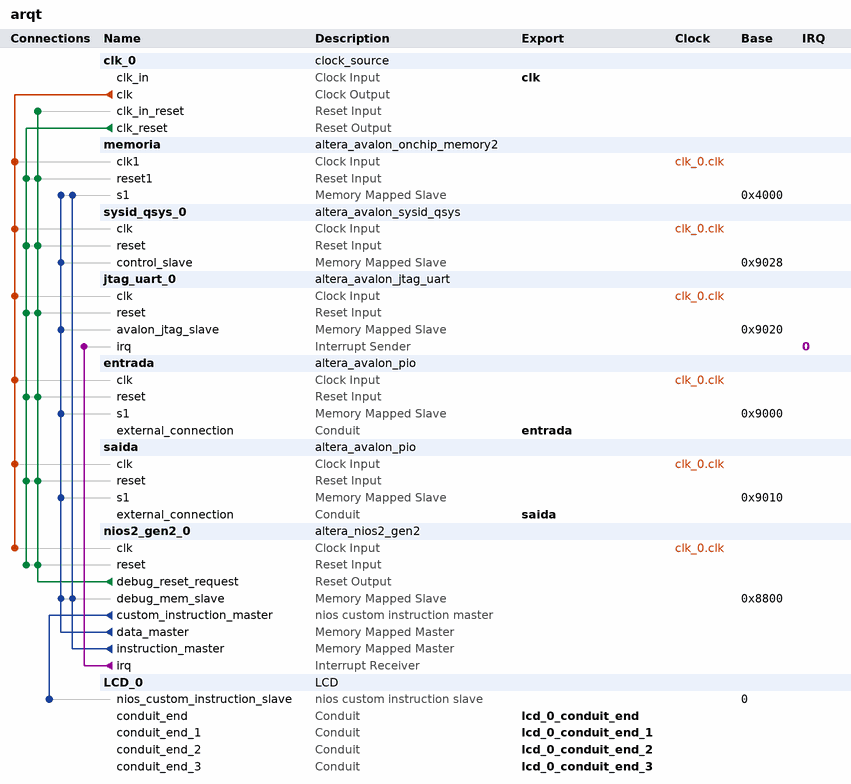
[diagram p0: system contents]
# Platform Designer (Qsys) system arqt, Cyclone IV E EP4CE6E22C8
# Parameters at their usual value, and those the tool derives, are not listed.
package require -exact qsys 15.0
create_system arqt
set_project_property DEVICE_FAMILY {Cyclone IV E}
set_project_property DEVICE EP4CE6E22C8

add_instance clk_0 clock_source 15.0
set_instance_parameter_value clk_0 clockFrequency 50000000

add_instance memoria altera_avalon_onchip_memory2 15.0
set_instance_parameter_value memoria dataWidth 32
set_instance_parameter_value memoria dualPort false
set_instance_parameter_value memoria initMemContent true
set_instance_parameter_value memoria initializationFileName onchip_mem.hex
set_instance_parameter_value memoria memorySize 8196

add_instance sysid_qsys_0 altera_avalon_sysid_qsys 15.0
set_instance_parameter_value sysid_qsys_0 id 0

add_instance jtag_uart_0 altera_avalon_jtag_uart 15.0
set_instance_parameter_value jtag_uart_0 simInteractiveOptions NO_INTERACTIVE_WINDOWS

add_instance entrada altera_avalon_pio 15.0
set_instance_parameter_value entrada direction Input
set_instance_parameter_value entrada width 4

add_instance saida altera_avalon_pio 15.0
set_instance_parameter_value saida direction Output
set_instance_parameter_value saida width 4

add_instance nios2_gen2_0 altera_nios2_gen2 15.0
set_instance_parameter_value nios2_gen2_0 dcache_size 2048
set_instance_parameter_value nios2_gen2_0 exceptionSlave memoria.s1
set_instance_parameter_value nios2_gen2_0 icache_size 4096
set_instance_parameter_value nios2_gen2_0 impl Tiny
set_instance_parameter_value nios2_gen2_0 resetSlave memoria.s1

add_instance LCD_0 LCD 1.0

# connections
add_connection clk_0.clk entrada.clk clock
add_connection clk_0.clk jtag_uart_0.clk clock
add_connection clk_0.clk memoria.clk1 clock
add_connection clk_0.clk nios2_gen2_0.clk clock
add_connection clk_0.clk saida.clk clock
add_connection clk_0.clk sysid_qsys_0.clk clock
add_connection clk_0.clk_reset entrada.reset reset
add_connection clk_0.clk_reset jtag_uart_0.reset reset
add_connection clk_0.clk_reset memoria.reset1 reset
add_connection clk_0.clk_reset nios2_gen2_0.reset reset
add_connection clk_0.clk_reset saida.reset reset
add_connection clk_0.clk_reset sysid_qsys_0.reset reset
add_connection nios2_gen2_0.debug_reset_request clk_0.clk_in_reset reset
add_connection nios2_gen2_0.debug_reset_request entrada.reset reset
add_connection nios2_gen2_0.debug_reset_request jtag_uart_0.reset reset
add_connection nios2_gen2_0.debug_reset_request memoria.reset1 reset
add_connection nios2_gen2_0.debug_reset_request nios2_gen2_0.reset reset
add_connection nios2_gen2_0.debug_reset_request saida.reset reset
add_connection nios2_gen2_0.debug_reset_request sysid_qsys_0.reset reset
add_connection nios2_gen2_0.data_master entrada.s1 avalon
set_connection_parameter_value nios2_gen2_0.data_master/entrada.s1 baseAddress 0x9000
add_connection nios2_gen2_0.data_master jtag_uart_0.avalon_jtag_slave avalon
set_connection_parameter_value nios2_gen2_0.data_master/jtag_uart_0.avalon_jtag_slave baseAddress 0x9020
add_connection nios2_gen2_0.data_master memoria.s1 avalon
set_connection_parameter_value nios2_gen2_0.data_master/memoria.s1 baseAddress 0x4000
add_connection nios2_gen2_0.data_master nios2_gen2_0.debug_mem_slave avalon
set_connection_parameter_value nios2_gen2_0.data_master/nios2_gen2_0.debug_mem_slave baseAddress 0x8800
add_connection nios2_gen2_0.data_master saida.s1 avalon
set_connection_parameter_value nios2_gen2_0.data_master/saida.s1 baseAddress 0x9010
add_connection nios2_gen2_0.data_master sysid_qsys_0.control_slave avalon
set_connection_parameter_value nios2_gen2_0.data_master/sysid_qsys_0.control_slave baseAddress 0x9028
add_connection nios2_gen2_0.instruction_master memoria.s1 avalon
set_connection_parameter_value nios2_gen2_0.instruction_master/memoria.s1 baseAddress 0x4000
add_connection nios2_gen2_0.instruction_master nios2_gen2_0.debug_mem_slave avalon
set_connection_parameter_value nios2_gen2_0.instruction_master/nios2_gen2_0.debug_mem_slave baseAddress 0x8800
add_connection nios2_gen2_0.irq jtag_uart_0.irq interrupt
set_connection_parameter_value nios2_gen2_0.irq/jtag_uart_0.irq irqNumber 0
add_connection nios2_gen2_0.custom_instruction_master LCD_0.nios_custom_instruction_slave nios_custom_instruction
set_connection_parameter_value nios2_gen2_0.custom_instruction_master/LCD_0.nios_custom_instruction_slave CIName lcd_0
set_connection_parameter_value nios2_gen2_0.custom_instruction_master/LCD_0.nios_custom_instruction_slave baseAddress 0

# exported interfaces
add_interface clk clock sink
set_interface_property clk EXPORT_OF clk_0.clk_in
add_interface entrada conduit end
set_interface_property entrada EXPORT_OF entrada.external_connection
add_interface lcd_0_conduit_end conduit end
set_interface_property lcd_0_conduit_end EXPORT_OF LCD_0.conduit_end
add_interface lcd_0_conduit_end_1 conduit end
set_interface_property lcd_0_conduit_end_1 EXPORT_OF LCD_0.conduit_end_1
add_interface lcd_0_conduit_end_2 conduit end
set_interface_property lcd_0_conduit_end_2 EXPORT_OF LCD_0.conduit_end_2
add_interface lcd_0_conduit_end_3 conduit end
set_interface_property lcd_0_conduit_end_3 EXPORT_OF LCD_0.conduit_end_3
add_interface saida conduit end
set_interface_property saida EXPORT_OF saida.external_connection

set_interconnect_requirement {$system} qsys_mm.clockCrossingAdapter HANDSHAKE
set_interconnect_requirement {$system} qsys_mm.enableEccProtection FALSE
set_interconnect_requirement {$system} qsys_mm.insertDefaultSlave FALSE
set_interconnect_requirement {$system} qsys_mm.maxAdditionalLatency 1

save_system arqt.qsys
